# EAGLE design untitled (EAGLE 5.06)
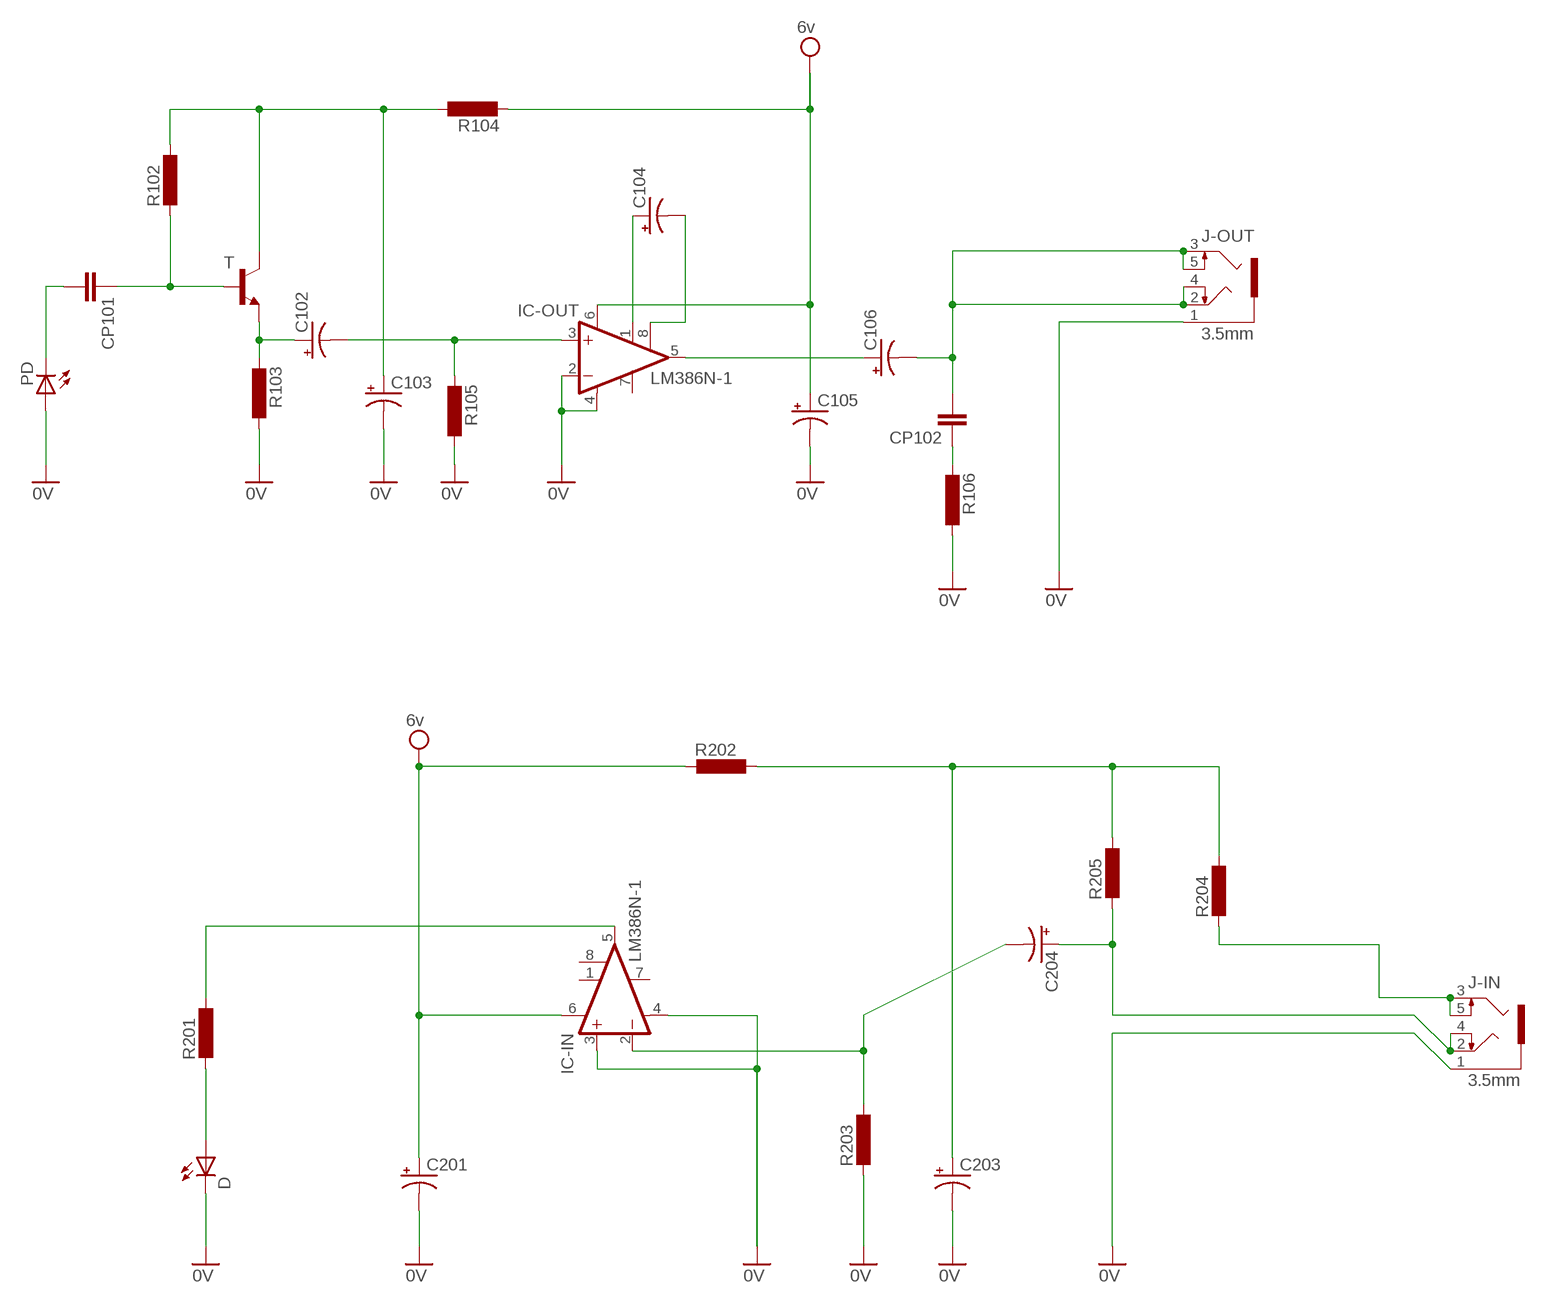
[diagram p0: schematic, sheet 1]

## Parts
C102  CPOL-USTT5D7  [TT5D7]
C103  CPOL-USTT5D7  [TT5D7]
C104  CPOL-USTT5D7  [TT5D7]
C105  CPOL-USTT5D7  [TT5D7]
C106  CPOL-USTT5D7  [TT5D7]
C201  CPOL-USTT5D7  [TT5D7]
C203  CPOL-USTT5D7  [TT5D7]
C204  CPOL-USTT5D7  [TT5D7]
CP101  C-EU050-030X075  [C050-030X075]
CP102  C-EU050-030X075  [C050-030X075]
D  LED5MM  [LED5MM]
IC-IN  LM386N-1  [DIL08]
IC-OUT  LM386N-1  [DIL08]
J-IN  3.5mm  1503_09  [1503_09]
J-OUT  3.5mm  1503_09  [1503_09]
PD  LED5MM  [LED5MM]
R102  L-EU0204/7  [0204/7]
R103  L-EU0204/7  [0204/7]
R104  L-EU0204/7  [0204/7]
R105  L-EU0204/7  [0204/7]
R106  L-EU0204/7  [0204/7]
R201  L-EU0204/7  [0204/7]
R202  L-EU0204/7  [0204/7]
R203  L-EU0204/7  [0204/7]
R204  L-EU0204/7  [0204/7]
R205  L-EU0204/7  [0204/7]
T  2SC1815  [TO92-ECB]

## Nets
CP2: CP102.1 R106.2
N$1: CP101.2 PD.K(C)
N$2: C103.+ R102.1 R104.1 T.C
N$3: C102.- IC-OUT.3(+IN) R105.2
N$4: C102.+ R103.2 T.E
N$5: C104.+ IC-OUT.1(GAIN)
N$6: C104.- IC-OUT.8(GAIN)
N$7: CP101.1 R102.2 T.B
N$8: C106.+ IC-OUT.5(OUT)
N$9: IC-IN.5(OUT) R201.1
N$10: D.A R201.2
N$11: J-IN.3 J-IN.5 R204.2
N$12: C204.- IC-IN.2(-IN) R203.1
N$14: C106.- CP102.2 J-OUT.2 J-OUT.3 J-OUT.4 J-OUT.5
N$18: C105.+ C201.+ IC-IN.6(VS) IC-OUT.6(VS) R104.2 R202.2 ; supply symbol labelled 6v
N$21: C203.+ R202.1 R204.1 R205.1
N$22: C204.+ J-IN.2 J-IN.4 R205.2
N$23: C103.- C105.- C201.- C203.- D.K(C) IC-IN.3(+IN) IC-IN.4(GND) IC-OUT.2(-IN) IC-OUT.4(GND) J-IN.1 J-OUT.1 PD.A R103.1 R105.1 R106.1 R203.2 ; supply symbol labelled 0V
Unconnected: IC-IN.1(GAIN) IC-IN.7(BYPASS) IC-IN.8(GAIN) IC-OUT.7(BYPASS)

## Library data of the parts
C102-C106 C201 C203 C204 = resistor:CPOL-US: POLARIZED CAPACITOR, American symbol
CP101 CP102 = resistor:C-EU: CAPACITOR, European symbol
D PD = led:LED: LED OSRAM: - CHIPLED LG R971, LG N971, LY N971, LG Q971, LY Q971, LO R971, LY R971 LH N974, LH R974 LS Q976, LO Q976, LY Q976 LO Q996 - Hyper CHIPLED LW Q18S LB Q993, LB Q99A, LB R99A - SideLED LS A670, LO A670, LY A670, LG A670, LP A670 LB A673, LV A673, LT A673, LW A673 LH A674 LY A675 LS A676, LA A676, LO A676, LY A676, LW A676 LS A679, LY A679, LG A679 - Hyper Micro SIDELED® LS Y876, LA Y876, LO Y876, LY Y876 LT Y87S - SmartLED LW L88C, LW L88S LB L89C, LB L89S, LG L890 LS L89K, LO L89K, LY L89K LS L896, LA L896, LO L896, LY L896 - TOPLED LS T670, LO T670, LY T670, LG T670, LP T670 LSG T670, LSP T670, LSY T670, LOP T670, LYG T670 LG T671, LOG T671, LSG T671 LB T673, LV T673, LT T673, LW T673 LH T674 LS T676, LA T676, LO T676, LY T676, LB T676, LH T676, LSB T676, LW T676 LB T67C, LV T67C, LT T67C, LS T67K, LO T67K, LY T67K, LW E67C LS E67B, LA E67B, LO E67B, LY E67B, LB E67C, LV E67C, LT E67C LW T67C LS T679, LY T679, LG T679 LS T770, LO T770, LY T770, LG T770, LP T770 LB T773, LV T773, LT T773, LW T773 LH T774 LS E675, LA E675, LY E675, LS T675 LS T776, LA T776, LO T776, LY T776, LB T776 LHGB T686 LT T68C, LB T68C - Hyper Mini TOPLED® LB M676 - Mini TOPLED Santana® LG M470 LS M47K, LO M47K, LY M47K Source: http://www.osram.convergy.de LUXEON: - LUMILED® LXK2-PW12-R00, LXK2-PW12-S00, LXK2-PW14-U00, LXK2-PW14-V00 LXK2-PM12-R00, LXK2-PM12-S00, LXK2-PM14-U00 LXK2-PE12-Q00, LXK2-PE12-R00, LXK2-PE12-S00, LXK2-PE14-T00, LXK2-PE14-U00 LXK2-PB12-K00, LXK2-PB12-L00, LXK2-PB12-M00, LXK2-PB14-N00, LXK2-PB14-P00, LXK2-PB14-Q00 LXK2-PR12-L00, LXK2-PR12-M00, LXK2-PR14-Q00, LXK2-PR14-R00 LXK2-PD12-Q00, LXK2-PD12-R00, LXK2-PD12-S00 LXK2-PH12-R00, LXK2-PH12-S00 LXK2-PL12-P00, LXK2-PL12-Q00, LXK2-PL12-R00 Source: www.luxeon.com KINGBRIGHT: KA-3528ASYC Source: www.kingbright.com
IC-IN IC-OUT = linear:LM386?-*: Low Voltage Audio Power Amplifier Source: http://cache.national.com/ds/LM/LM386.pdf
J-IN J-OUT = Gataro_parts:1503_09: Jack connectors according to JISC 6560, 3.5 mm Klinkeneinbaukupplung nach JISC 6560, 3,5 mm, 3-polig/ stereo, abgewinkelte Ausführung, mit 2 Öffnern und Lötaugen, für Leiterplatten Rückseitenmontage Source: http://www.lumberg.com/Produkte/PDFs/1503_09.pdf From: Standard Library con-lumberg.lbr
R102-R106 R201-R205 = resistor:L-EU: INDUCTOR, European symbol
T = transistor:2SC1815: NPN EPITAXIAL TRANSISTOR Source: TOSHIBA .. 2SC1815 1.pdf

## Board
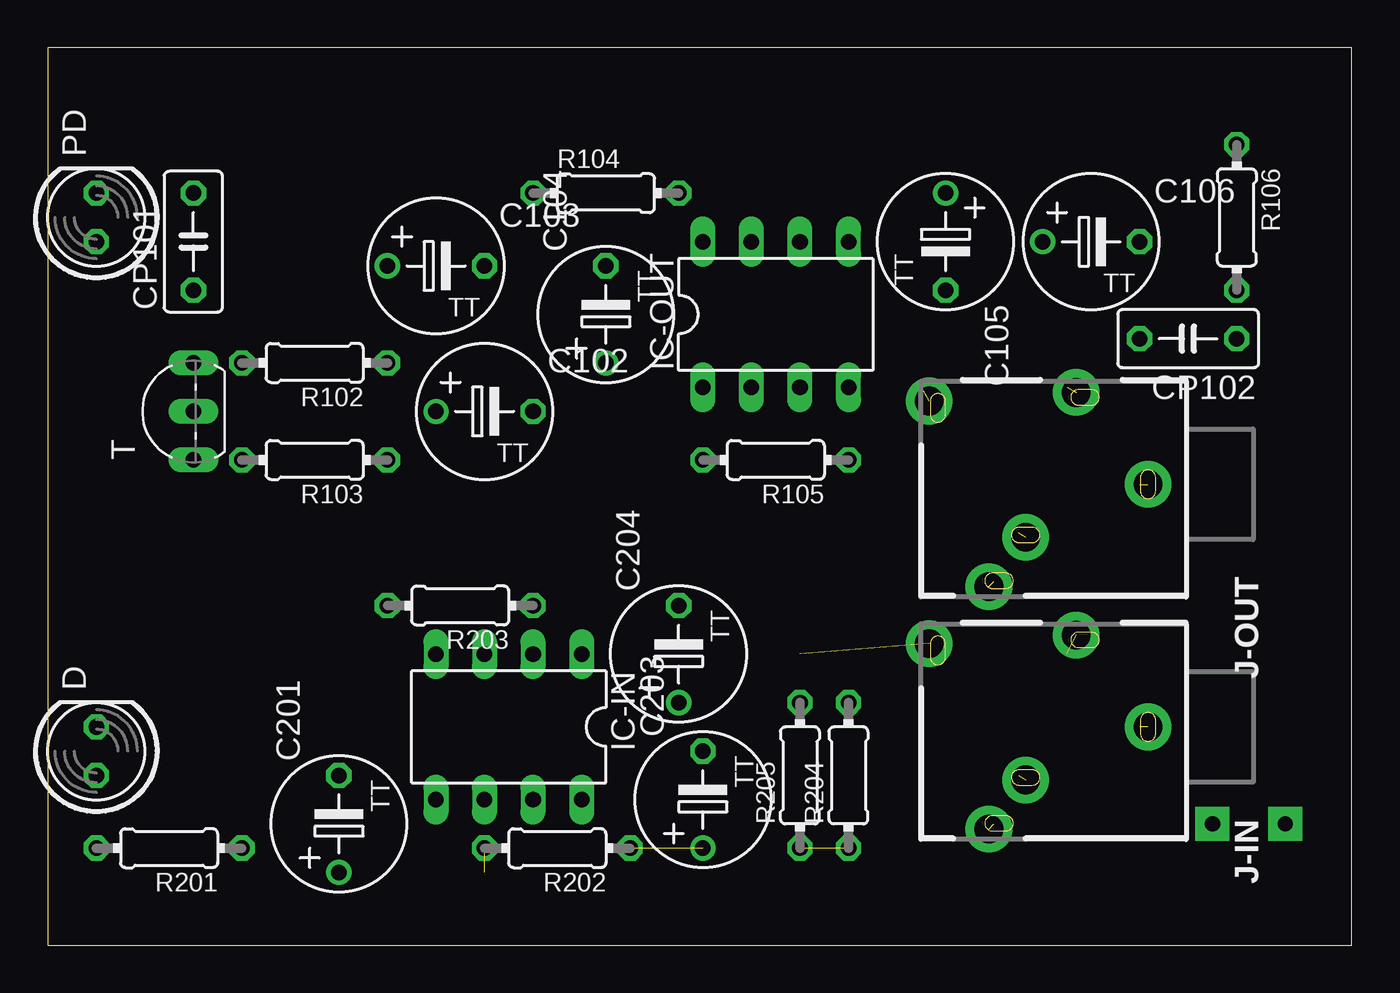
[diagram p1: board, top side]
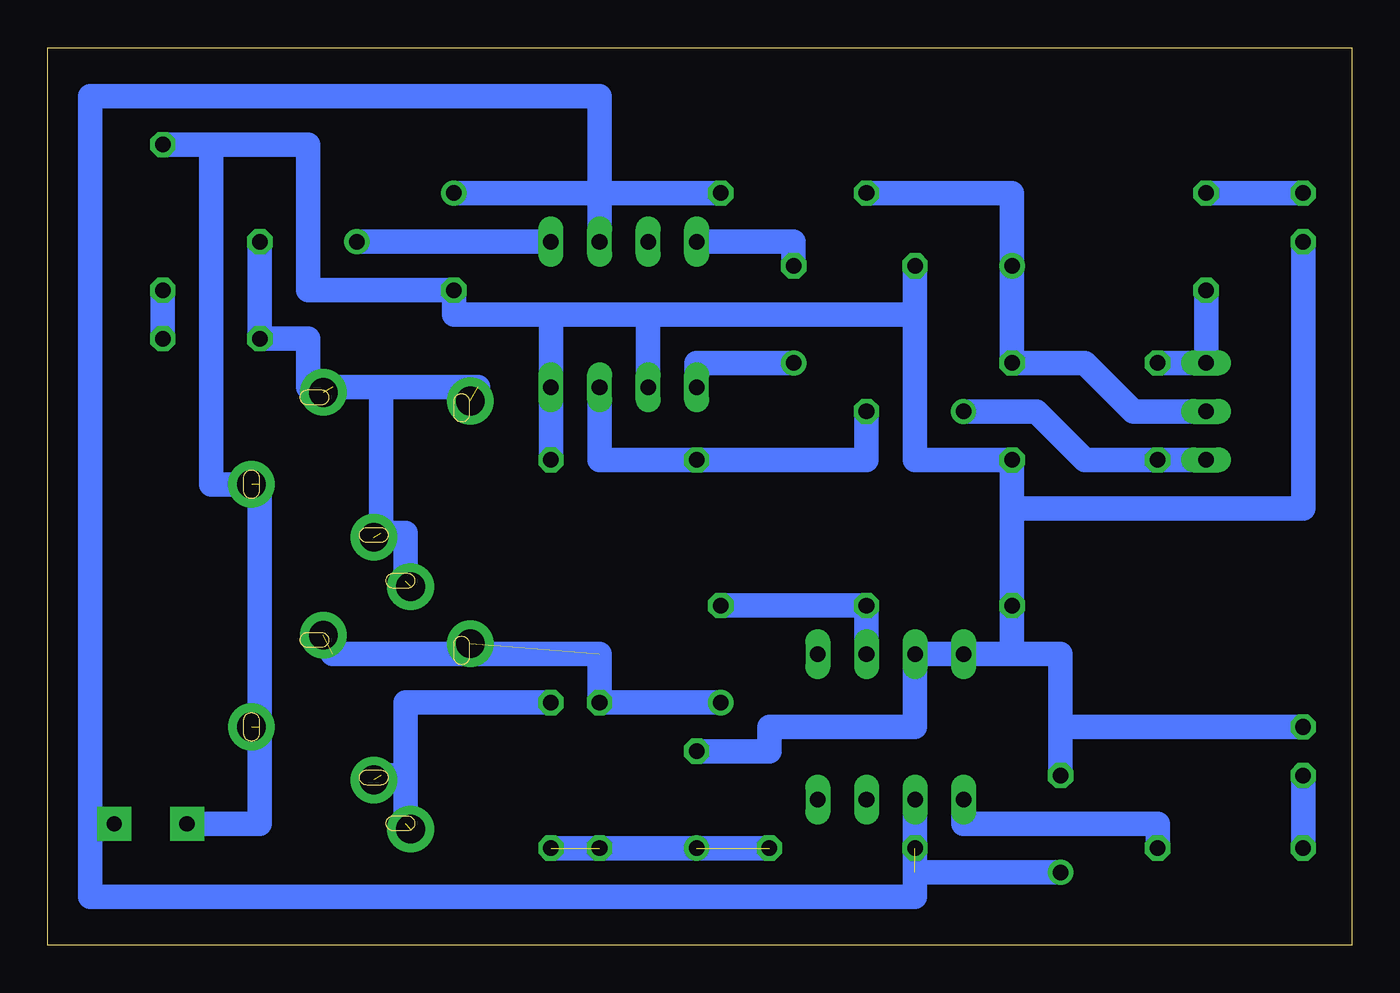
[diagram p2: board, bottom side, seen from below]

Size 68.25 x 46.98 mm. Coordinates in mm from the lower left corner, seen from the top.
Outline: 0,0 68.25,0 68.25,46.98 0,46.98 0,0
Copper layers (1*16): Top 0.035mm / dielectric 1.5mm / Bottom 0.035mm
Design rules "default": minimum track width 10mil, minimum drill 24mil, track to track 8mil, track to pad 8mil, pad to pad 8mil, via to via 8mil, smd to smd 8mil, copper to edge 40mil, drill to drill 8mil, minimum pad ring 10mil, minimum via ring 8mil, stop-mask expansion 4mil, vias tented up to drill 0mil, thermal gap 10mil

### Footprints (pad centres in the part's own frame; a part is rotated, then mirrored left to right if it is on the bottom)
TT5D7 = drill 0.813 round: + -2.54,0 | drill 0.813 octagon: - 2.54,0
C050-030X075 = drill 0.813 octagon: 1 -2.54,0; 2 2.54,0
LED5MM = drill 0.813 octagon: A -1.27,0; K 1.27,0
DIL08 = drill 0.813 long: 1 -3.81,-3.81; 2 -1.27,-3.81; 3 1.27,-3.81; 4 3.81,-3.81; 5 3.81,3.81; 6 1.27,3.81; 7 -1.27,3.81; 8 -3.81,3.81
1503_09 = drill 1.499 pad 2.438 round: 1 0,-2.1; 2 -4.804,-5.857; 3 5.355,-10.433; 4 -4.356,-13.557; 5 2.777,-8.5
0204/7 = drill 0.813 octagon: 1 -3.81,0; 2 3.81,0
TO92-ECB = drill 0.813 long: B 2.54,0; C 0,0; E -2.54,0

### Placement (x,y rotation side)
C102  22.86,27.94 0 top
C103  20.32,35.56 0 top
C104  29.21,33.02 90 top
C105  46.99,36.83 270 top
C106  54.61,36.83 0 top
C201  15.24,6.35 90 top
C203  34.29,7.62 90 top
C204  33.02,15.24 90 top
CP101  7.62,36.83 90 top
CP102  59.69,31.75 180 top
D  2.54,10.16 90 top
IC-IN  24.13,11.43 180 top
IC-OUT  38.1,33.02 0 top
J-IN  59.69,11.43 270 top
J-OUT  59.69,24.13 270 top
PD  2.54,38.1 90 top
R102  13.97,30.48 180 top
R103  13.97,25.4 180 top
R104  29.21,39.37 0 top
R105  38.1,25.4 180 top
R106  62.23,38.1 270 top
R201  6.35,5.08 180 top
R202  26.67,5.08 180 top
R203  21.59,17.78 180 top
R204  41.91,8.89 90 top
R205  39.37,8.89 90 top
T  7.62,27.94 90 top

### Tracks (layer width: path | path; a pad name or v marks a point on that pad's centre or on a via)
CP2
  Bottom 1.27: CP102.1 R106.2
N$1
  Bottom 1.27: PD.K CP101.2
N$2
  Bottom 1.27: T.C 11.43,27.94 13.97,30.48 R102.1 C103.+ 17.78,39.37 R104.1
N$3
  Bottom 1.27: IC-OUT.3 39.37,25.4 R105.2 25.4,25.4 C102.-
N$4
  Bottom 1.27: T.E R103.2 13.97,25.4 16.51,27.94 C102.+
N$5
  Bottom 1.27: C104.+ 34.29,30.48 IC-OUT.1
N$6
  Bottom 1.27: IC-OUT.8 29.21,36.83 C104.-
N$7
  Bottom 1.27: CP101.1 T.B R102.2
N$8
  Bottom 1.27: IC-OUT.5 C106.+
N$9
  Bottom 1.27: IC-IN.5 20.32,6.35 10.16,6.35 R201.1
N$10
  Bottom 1.27: R201.2 D.A
N$11  (2 unrouted)
  Bottom 1.27: 49.53,8.89 50.8,8.89 | 49.53,8.89 49.53,6.35 | R204.2 49.53,12.7 49.53,8.89
N$12
  Bottom 1.27: C204.- R203.1 IC-IN.2
N$14  (4 unrouted)
  Bottom 1.27: 53.34,29.21 54.61,29.21 54.61,31.75 CP102.2 C106.- | 53.34,29.21 45.72,29.21 | 53.34,29.21 50.8,29.21 50.8,21.59 49.53,21.59 49.53,19.05
N$18  (via drill 0.8 pad 1.78)  (1 unrouted)
  Bottom 1.27: C201.+ 22.86,3.81 | 22.86,3.81 IC-IN.6 | 22.86,3.81 22.86,2.54 66.04,2.54 66.04,6.35 | 39.37,39.37 R104.2 | 39.37,39.37 IC-OUT.6 | 39.37,39.37 C105.+ | 66.04,6.35 66.04,44.45 39.37,44.45 39.37,39.37 | 66.04,6.35 v64.77,6.35
N$21  (2 unrouted)
  Bottom 1.27: R202.1 R204.1
N$22  (2 unrouted)
  Bottom 1.27: C204.+ R205.2 39.37,15.24 53.34,15.24
N$23  (via drill 0.8 pad 1.78)  (2 unrouted)
  Bottom 1.27: D.K 15.24,11.43 | 15.24,11.43 C201.- | 17.78,15.24 IC-IN.4 IC-IN.3 22.86,11.43 30.48,11.43 30.48,10.16 C203.- | 17.78,15.24 15.24,15.24 15.24,11.43 | 17.78,15.24 17.78,16.51 | 17.78,16.51 R203.2 | PD.A 2.54,22.86 17.78,22.86 | 17.78,22.86 R103.1 22.86,25.4 22.86,33.02 | 22.86,33.02 C103.- | R105.1 IC-OUT.4 41.91,33.02 | 36.83,33.02 41.91,33.02 | 36.83,33.02 IC-OUT.2 | 22.86,33.02 36.83,33.02 | 17.78,16.51 17.78,22.86 | 41.91,33.02 46.99,33.02 C105.- 54.61,34.29 54.61,41.91 59.69,41.91 | 59.69,41.91 R106.1 | 59.69,41.91 59.69,24.13 | 59.69,24.13 58.42,24.13 | 59.69,24.13 57.15,24.13 57.15,11.43 57.15,6.35 v60.96,6.35